# EasyEDA Pro project ProDoc_小板子变色龙0603_2025-04-27.epro

# Board 小板子变色龙0603
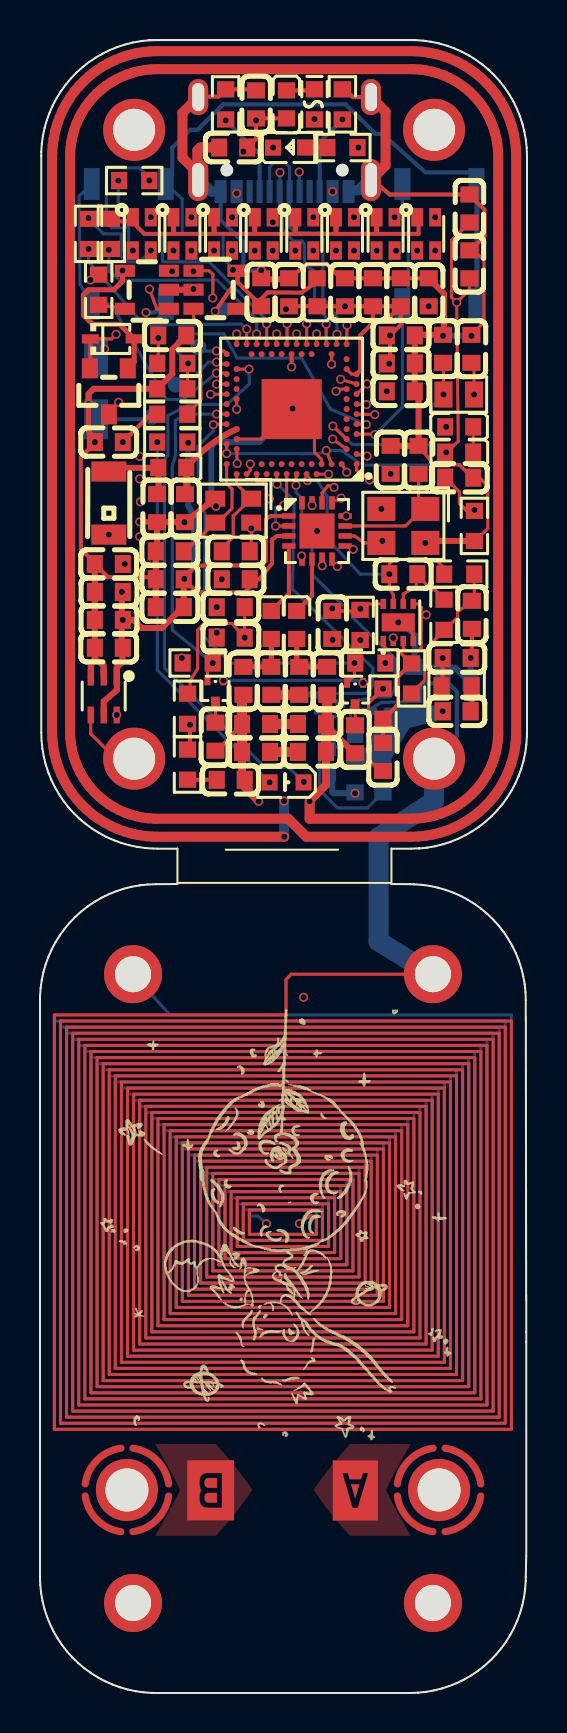
[diagram p0: board, top side]
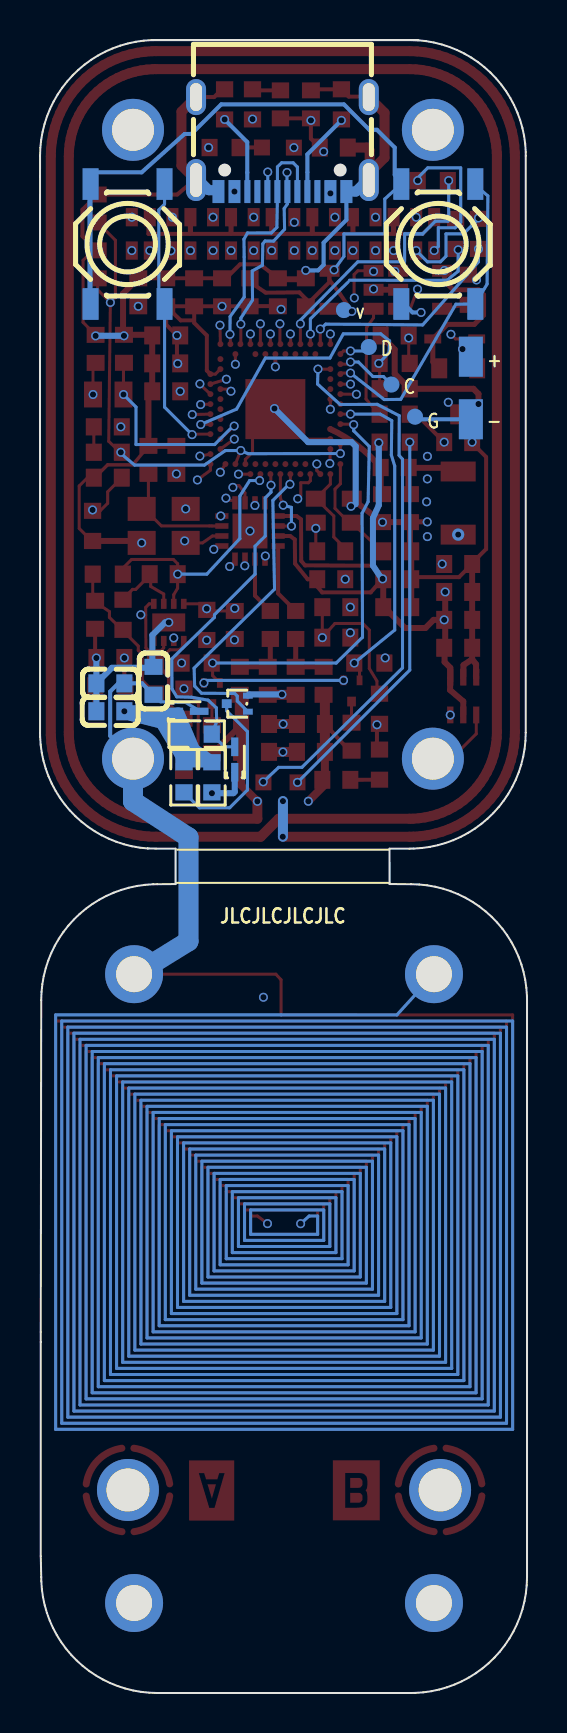
[diagram p1: board, bottom side, seen from below]

Outline 24.36 x 82.67 mm; copper layers: Top Layer, 内层1, Inner2, Bottom Layer. Coordinates in mm from the lower left corner of the outline.
Outline path: 5.46,82.67 18.77,82.67 ; 24.32,17.57 24.32,6.85 24.3,5.8 24.3,5.6 24.27,5.19 24.21,4.79 24.13,4.4 24.02,4.01 23.88,3.63 23.71,3.26 23.52,2.9 23.31,2.56 23.07,2.23 22.81,1.92 22.53,1.63 22.23,1.36 21.91,1.11 21.57,0.88 21.22,0.68 20.86,0.5 20.48,0.35 20.1,0.23 19.71,0.13 19.31,0.06 18.9,0.02 18.5,0 15.01,0 9.39,0 5.8,0 5.6,0 5.19,0.03 4.79,0.09 4.4,0.17 4.01,0.28 3.63,0.42 3.26,0.59 2.9,0.78 2.56,0.99 2.23,1.23 1.92,1.49 1.63,1.77 1.36,2.07 1.11,2.39 0.88,2.73 0.68,3.08 0.5,3.44 0.35,3.82 0.22,4.2 0.13,4.59 0.06,4.99 0.01,5.4 0,5.8 0,34.65 0,34.85 0.03,35.26 0.09,35.66 0.17,36.05 0.28,36.44 0.42,36.82 0.59,37.19 0.78,37.55 0.99,37.89 1.23,38.22 1.49,38.53 1.77,38.82 2.07,39.09 2.39,39.34 2.73,39.57 3.08,39.77 3.44,39.95 3.82,40.1 4.2,40.23 4.59,40.32 4.99,40.39 5.4,40.44 5.8,40.45 6.87,40.46 6.88,42.23 5.86,42.23 5.66,42.23 5.26,42.26 4.86,42.32 4.46,42.4 4.07,42.51 3.69,42.65 3.32,42.82 2.96,43.01 2.62,43.22 2.29,43.46 1.98,43.72 1.69,44 1.42,44.3 1.17,44.62 0.95,44.96 0.74,45.31 0.57,45.67 0.41,46.05 0.29,46.43 0.19,46.82 0.12,47.22 0.08,47.63 0.06,48.03 0.06,76.88 0.06,77.08 0.09,77.48 0.15,77.88 0.23,78.28 0.34,78.67 0.48,79.05 0.65,79.42 0.84,79.77 1.05,80.12 1.29,80.44 1.55,80.75 1.83,81.05 2.13,81.32 2.45,81.57 2.79,81.79 3.14,81.99 3.5,82.17 3.88,82.32 4.26,82.45 4.65,82.55 5.05,82.62 5.46,82.66 5.86,82.67 18.56,82.67 18.76,82.67 19.17,82.64 19.57,82.58 19.96,82.5 20.35,82.39 20.73,82.25 21.1,82.09 21.46,81.9 21.8,81.68 22.13,81.44 22.44,81.18 22.73,80.9 23,80.6 23.25,80.28 23.48,79.95 23.68,79.6 23.86,79.23 24.01,78.86 24.13,78.47 24.23,78.08 24.3,77.68 24.35,77.28 24.36,76.87 24.36,75.84 24.36,65.14 24.36,48.02 24.36,47.82 24.33,47.42 24.27,47.02 24.19,46.62 24.08,46.23 23.94,45.85 23.77,45.48 23.58,45.12 23.37,44.78 23.13,44.45 22.87,44.14 22.59,43.85 22.29,43.58 21.97,43.33 21.63,43.1 21.28,42.9 20.92,42.72 20.54,42.57 20.16,42.45 19.77,42.35 19.37,42.28 18.96,42.24 18.97,42.24 18.56,42.23 17.58,42.23 17.58,40.46 18.5,40.45 18.7,40.45 19.11,40.42 19.51,40.36 19.9,40.28 20.29,40.17 20.67,40.03 21.04,39.86 21.4,39.67 21.74,39.46 22.07,39.22 22.38,38.96 22.67,38.68 22.94,38.38 23.19,38.06 23.42,37.72 23.62,37.37 23.8,37.01 23.95,36.63 24.08,36.25 24.17,35.86 24.24,35.46 24.29,35.06 24.3,34.65 24.32,18.06 24.32,17.54
Stack: Top Layer 0.035mm / Dielectric1 1.51mm FR4 er 4.5 / 内层1 0.035mm / Dielectric2 0.48mm PP er 4.5 / Inner2 0.035mm / Dielectric3 0.48mm PP er 4.5 / Bottom Layer 0.035mm

## Design rules (mm)
template: 自定义配置
spacing copperThickness1oz (default): track to track 0.102, other pairs 0 to 0.3
spacing copperThickness2oz: track to track 0.203, other pairs 0.152 to 0.3
track width copperThickness1oz (default): min 0.127, default 0.254, max 2.54
track width copperThickness2oz: min 0.203, default 0.254, max 2.54
differential pair differentialPair (default): width min 0.127, default 0.254, max 2.54; gap min 0.152, default 0.152
via viaSize (default): diameter min 0.4, default 0.61, max 10; hole min 0.3, default 0.305, max 6.3

## Placement (name value [footprint] x y rotation side)
C1  12pF  [C0603]  18.94 61.67 90 top
C2  12pF  [C0603]  17.54 61.67 90 top
C3  100nF  [C0603]  6.49 54.31 180 top
C4  100nF  [C0603]  9.79 55.7 180 top
C5  100nF  [C0603]  6.49 55.7 180 top
C6  100nF  [C0603]  3.44 55.07 180 top
C7  4.7uF  [C0603]  3.44 53.67 180 top
C8  1uF  [C0603]  9.54 54.31 180 top
C9  100nF  [C0603]  9.54 52.78 180 top
C10  1nF/NP0  [C0603]  8.78 47.83 90 top
C11  1nF/NP0  [C0603]  15.76 47.7 90 top
C12  47pF/NP0  [C0603]  10.17 50.62 90.2 top
C13  47pF/NP0  [C0603]  14.37 50.62 270.1 top
C14  47pF/NP0  [C0603]  11.57 50.62 270 top
C15  47pF/NP0  [C0603]  12.97 50.62 270 top
C16  8pF  [C0603]  13.6 48.46 180 top
C17  8pF  [C0603]  10.81 48.46 0 top
C18  150pF/NP0  [C0603]  10.81 47.07 0 top
C19  150pF/NP0  [C0603]  13.6 47.07 180 top
C20  100nF  [C0603]  9.54 45.67 0 top
C21  4.7uF  [C0603]  3.44 52.27 0 top
C22  -  [C0603]  20.84 50.5 0 bottom
C23  2.2nF/C0G  [C0603]  18.68 50.62 90 bottom
C25  100nF  [C0603]  14.62 53.42 270 top
C26  100nF  [C0603]  21.6 53.93 270 top
C27  10nF  [C0603]  18.18 55.96 0 top
C28  100nF  [C0603]  20.97 60.78 180 top
C29  27nF  [C0603]  20.84 49.1 180 bottom
C30  10nF  [C0603]  20.84 49.1 180 top
C31  33nF  [C0603]  20.84 51.77 180 top
C32  4.7uF  [C0603]  9.67 77.29 180 top
C33  100nF  [C0603]  15.25 70.05 90 top
C34  4.7uF  [C0603]  19.45 70.05 90 top
C35  4.7uF  [C0603]  16.65 70.05 90 top
C36  12pF  [C0603]  21.58 67.23 270 top
C37  12pF  [C0603]  20.16 67.23 270 top
C38  100nF  [C0603]  18.05 65.1 180 top
C39  4.7uF  [C0603]  18.05 67.9 180 top
C40  12pF  [C0603]  6.49 57.1 180 top
C41  12pF  [C0603]  9.79 57.1 0 top
C42  100nF  [C0603]  18.05 70.05 90 top
C43  100nF  [C0603]  18.05 66.5 180 top
C44  1uF  [C0603]  21.48 71.45 270 top
C45  47nF  [C0603]  21.48 74.25 270 top
C46  100nF  [C0603]  12.46 70.05 90 top
C47  1nF  [C0603]  17.16 46.81 90 top
D1  1N4148WT  [SOD-523_L1.2-W0.8-LS1.6-RD]  17.03 49.1 180 bottom
D2  1N4148WT  [SOD-523_L1.2-W0.8-LS1.6-RD]  14.62 46.69 90 bottom
F1  F0603E1R25FSTR  [F0603]  13.73 79.45 270 top
L1  680nH  [L0603]  11.57 53.42 90 top
L2  680nH  [L0603]  12.84 53.42 90 top
L3  4.7nH  [L0603]  6.62 61.29 180 top
L4  10uH  [L0603]  20.97 63.32 0 top
L5  15nH  [L0603]  20.97 62.05 180 top
LED1  RSGHBHW1  [LED-ARRAY-SMD_4P-L1.6-W1.6-TR_EVERLIGHT_RSGHBHW1-S03]  19.32 72.98 90 top
LED2  RSGHBHW1  [LED-ARRAY-SMD_4P-L1.6-W1.6-TR_EVERLIGHT_RSGHBHW1-S03]  17.29 72.98 90 top
LED3  RSGHBHW1  [LED-ARRAY-SMD_4P-L1.6-W1.6-TR_EVERLIGHT_RSGHBHW1-S03]  15.25 72.98 90 top
LED4  RSGHBHW1  [LED-ARRAY-SMD_4P-L1.6-W1.6-TR_EVERLIGHT_RSGHBHW1-S03]  9.16 72.98 90 top
LED5  RSGHBHW1  [LED-ARRAY-SMD_4P-L1.6-W1.6-TR_EVERLIGHT_RSGHBHW1-S03]  11.19 72.98 90 top
LED6  RSGHBHW1  [LED-ARRAY-SMD_4P-L1.6-W1.6-TR_EVERLIGHT_RSGHBHW1-S03]  13.22 72.98 90 top
LED8  RSGHBHW1  [LED-ARRAY-SMD_4P-L1.6-W1.6-TR_EVERLIGHT_RSGHBHW1-S03]  5.09 72.98 90 top
LED9  RSGHBHW1  [LED-ARRAY-SMD_4P-L1.6-W1.6-TR_EVERLIGHT_RSGHBHW1-S03]  7.13 72.98 90 top
NOREF  -  [Pad_e1377]  9.16 69.17 270 top
NOREF#2  -  [Pad_e1375]  6.78 65.44 270 top
NOREF#3  -  [Pad_e1382]  19.66 35.95 180 top
NOREF#4  -  [Pad_ie1378]  2.81 66.83 0 top
NOREF#5  -  [Pad_ie1373]  2.81 63.7 0 top
NOREF#6  -  [Pad_e1376]  7.91 67.32 270 top
NOREF#7  -  [Pad_e1384]  19.96 10.16 180 top
NOREF#8  -  [Pad_e1381]  4.66 4.5 270 top
NOREF#9  -  [Pad_e1380]  4.66 35.95 180 top
NOREF#10  -  [Pad_e1379]  4.35 10.16 180 top
NOREF#11  -  [Pad_e1383]  19.66 4.5 270 top
NOREF#12  -  [Pad_e1374]  5.6 63.83 270 top
P1  -  [M1.6贴片螺母]  4.71 78.18 0 top
P2  -  [M1.6贴片螺母]  19.71 78.18 0 top
P3  -  [M1.6贴片螺母]  4.71 46.73 0 top
P4  -  [M1.6贴片螺母]  19.71 46.73 0 top
PIC1  -  [小王子图_23_22]  12.16 23.17 180 top
Q1  WNM3013-3/TR  [SOT-723_L1.2-W0.8-P0.40-LS1.2-BR]  15.76 49.99 90 top
Q2  WNM3013-3/TR  [SOT-723_L1.2-W0.8-P0.40-LS1.2-BR]  8.78 50.12 90 top
Q3  WNM3013-3/TR  [SOT-723_L1.2-W0.8-P0.40-LS1.2-BR]  14.49 49.48 180 bottom
Q4  AO3401A  [SOT-23_L2.9-W1.3-P1.90-LS2.4-BR]  3.44 65.1 90 top
R1  5.1K  [R0603]  9.29 79.45 90 top
R2  5.1K  [R0603]  15.13 79.45 90 top
R3  1K  [R0603]  3.57 72.98 90 top
R4  2K  [R0603]  4.71 75.64 0 top
R5  1K  [R0603]  2.43 72.98 90 top
R6  2K  [R0603]  6.62 62.56 180 top
R7  100K  [R0603]  7.89 51.51 0 top
R8  100K  [R0603]  16.52 51.51 0 top
R9  5.1K  [R0603]  7.38 46.43 270 top
R10  100K  [R0603]  6.62 63.96 0 top
R11  1M  [R0603]  6.62 66.5 0 top
R12  820R  [R0603]  7.38 49.23 270 top
R13  4.7K  [R0603]  2.94 70.18 90 top
R14  1M  [R0603]  6.62 65.23 180 top
R15  220R  [R0603]  17.16 45.8 270 bottom
R16  1K  [R0603]  15.13 77.29 180 top
R17  470K  [R0603]  16.52 47.96 180 bottom
R18  82R  [R0603]  18.59 50.74 270 top
R19  75R  [R0603]  20.21 53.93 90 top
R20  3K  [R0603]  20.97 55.96 0 top
R21  3K  [R0603]  21.73 58.37 90 top
R22  4.7K  [R0603]  16.02 53.42 90 top
R23  470K  [R0603]  15.76 45.8 90 bottom
R24  82R  [R0603]  20.84 50.37 180 top
R25  4.7K  [R0603]  17.16 49.48 270 top
SW1  -  [SW-SMD_4P-L5.2-W5.2-P3.70-LS6.4-BL]  19.98 72.47 270 bottom
SW2  -  [SW-SMD_4P-L5.2-W5.2-P3.70-LS6.4-BL]  4.44 72.47 270 bottom
U1  CHARGE  [LED0603-RD]  12.46 77.29 0 top
U2  LED0603  [LED0603-R-RD]  12.33 45.54 180 top
U3  -  [AQFN-73_L7.0-W7.0-P0.50-BL-EP4.8]  12.59 64.21 90 top
U4  13.56MHz  [QFN-16_L3.0-W3.0-P0.50-BL-EP1.7]  13.86 58.12 270 top
U5  10uF  [C0603]  6.62 67.9 180 top
U6  1uF  [C0603]  10.81 79.45 270 top
U7  RS2257XC6  [SC-70-6_L2.2-W1.3-P0.65-LS2.2-BR]  3.19 49.86 90 top
U8  1uF  [C0603]  11.06 70.05 270 top
U9  GS358-FR  [DFN-8_L2.0-W2.0-P0.50-BL-EP]  17.92 53.54 0 top
U10  100MHz/0R  [L0603]  13.86 70.05 90 top
U11  0.5pF  [C0603]  7.25 59.26 270 top
U12  0.8pF  [C0603]  5.86 59.26 270 top
U13  ANT3216LL00R2400A  [ANT-SMD_L3.2-W1.6]  3.44 59.51 90 top
U14  1uF  [C0603]  3.44 62.56 0 top
U15  RT9013-33GB  [SOT-23-5_L2.9-W1.6-P0.95-LS2.8-BR]  8.78 70.18 180 top
U16  100nF  [C0603]  3.44 56.47 0 top
U19  100MHz/600R  [L0603]  12.33 79.45 90 top
U31  LTH7R/4054  [SOT-23-5_L2.9-W1.6-P0.95-LS2.8-BR]  5.35 70.18 0 top
U32  SS14  [SOD-323_L1.7-W1.3-LS2.7-FD]  3.62 67.72 180 top
USB1  TYPE-C16PIN  [USB-C-SMD_TYPE-C16PIN]  12.24 77.46 0 bottom
X1  27.12MHz  [CRYSTAL-SMD_4P-L3.2-W2.5-BL]  18.18 58.37 180 top
X2  32MHz  [OSC-SMD_4P-L2.0-W1.6-BL]  9.67 59.13 180 top
X3  32.768kHz  [CRYSTAL-SMD_L2.0-W1.2]  20.95 64.94 0 top

## Footprints (pads in the part's own frame, mm; a bottom-side part is the same pattern mirrored in y, then rotated)
ANT-SMD_L3.2-W1.6
  rect 1x1.75 smd: 1(-1.578,0) 2(1.578,0)
AQFN-73_L7.0-W7.0-P0.50-BL-EP4.8
  rect 3x3 smd: 0(0,0)
  round 0.3 smd: A8(-3.25,-1.25) A10(-3.25,-0.75) A12(-3.25,-0.25) A14(-3.25,0.25) A16(-3.25,0.75) A18(-3.25,1.25) A20(-3.25,1.75) A22(-3.25,2.25) A23(-3.25,2.75) AA24(2.25,3.25) AB2(2.5,-2.75) AC5(2.75,-2) AC9(2.75,-1) AC11(2.75,-0.5) AC13(2.75,0) AC15(2.75,0.5) AC17(2.75,1) AC19(2.75,1.5) AC21(2.75,2) AC24(2.75,3.25) AD2(3.25,-2.75) AD4(3.25,-2.25) AD6(3.25,-1.75) AD8(3.25,-1.25) AD10(3.25,-0.75) AD12(3.25,-0.25) AD14(3.25,0.25) AD16(3.25,0.75) AD18(3.25,1.25) AD20(3.25,1.75) AD22(3.25,2.25) AD23(3.25,2.75) B1(-2.75,-3.25) B3(-2.75,-2.499) B5(-2.75,-2) B7(-2.75,-1.5) B9(-2.75,-1) B11(-2.75,-0.5) B13(-2.75,0) B15(-2.75,0.5) B17(-2.75,1) B19(-2.75,1.5) B24(-2.75,3.25) C1(-2.25,-3.25) D2(-2,-2.75) D23(-2,2.75) E24(-1.75,3.25) F2(-1.5,-2.75) F23(-1.5,2.75) G1(-1.25,-3.25) H2(-1,-2.75) H23(-1,2.75) J1(-0.75,-3.25) J24(-0.75,3.25) K2(-0.5,-2.75) L1(-0.25,-3.25) L24(-0.25,3.25) M2(0,-2.75) N1(0.25,-3.25) N24(0.25,3.25) P2(0.5,-2.75) P23(0.5,2.75) R1(0.75,-3.25) R24(0.75,3.25) T2(1,-2.75) T23(1,2.75) U1(1.25,-3.25) U24(1.25,3.25) V23(1.5,2.75) W1(1.75,-3.25) W24(1.75,3.25) Y2(2,-2.75) Y23(2,2.75)
C0603
  rect 0.8x0.9 smd: 1(-0.7,0) 2(0.7,0)
CRYSTAL-SMD_4P-L3.2-W2.5-BL
  rect 1.4x1.2 smd: 1(-1.1,-0.85) 2(1.1,-0.85) 3(1.1,0.85) 4(-1.1,0.85)
CRYSTAL-SMD_L2.0-W1.2
  rect 0.9x1.3 smd: 1(-0.762,0) 2(0.762,0)
DFN-8_L2.0-W2.0-P0.50-BL-EP
  rect 0.28x0.505 smd: 1(-0.75,-0.927) 2(-0.25,-0.927) 3(0.25,-0.927) 4(0.75,-0.927) 5(0.75,0.927) 6(0.25,0.927) 7(-0.25,0.927) 8(-0.75,0.927)
  rect 1.65x0.9 smd: 9(0,0)
F0603
  rect 0.806x0.864 smd: 1(-0.753,0) 2(0.753,0)
L0603
  rect 0.8x0.864 smd: 1(-0.7,0) 2(0.7,0)
LED0603-R-RD
  rect 0.8x0.8 smd: 1(0.851,0) 2(-0.851,0)
LED0603-RD
  rect 0.8x0.8 smd: 1(-0.799,-0.004) 2(0.799,0.004)
LED-ARRAY-SMD_4P-L1.6-W1.6-TR_EVERLIGHT_RSGHBHW1-S03
  rect 0.917x0.6 smd: 1(0.834,0.45) 2(-0.834,0.45) 3(-0.834,-0.45) 4(0.834,-0.45)
M1.6贴片螺母
  round 3.1 hole 2.1: 1(0,0)
OSC-SMD_4P-L2.0-W1.6-BL
  rect 1x0.8 smd: 1(-0.9,-0.6) 2(0.9,-0.6) 3(0.9,0.6) 4(-0.9,0.6)
Pad_e1374
  round 0.8 smd far side: 1(0,0)
Pad_e1375
  round 0.8 smd far side: 1(0,0)
Pad_e1376
  round 0.8 smd far side: 1(0,0)
Pad_e1377
  round 0.8 smd far side: 1(0,0)
Pad_e1379
  round 3.099 hole 2.15: 2(0,0)
Pad_e1380
  round 2.9 hole 1.8: 1(0,0)
Pad_e1381
  round 2.9 hole 1.8: 1(0,0)
Pad_e1382
  round 2.9 hole 1.8: 1(0,0)
Pad_e1383
  round 2.9 hole 1.8: 1(0,0)
Pad_e1384
  round 3.099 hole 2.15: 2(0,0)
Pad_ie1373
  rect 1.2x2 smd far side: 1(0,0)
Pad_ie1378
  rect 1.2x2 smd far side: 1(0,0)
QFN-16_L3.0-W3.0-P0.50-BL-EP1.7
  rect 0.28x0.665 smd: 1(-0.75,-1.407) 2(-0.25,-1.407) 3(0.25,-1.407) 4(0.75,-1.407) 9(0.75,1.407) 10(0.25,1.407) 11(-0.25,1.407) 12(-0.75,1.407)
  rect 0.665x0.28 smd: 5(1.407,-0.75) 6(1.407,-0.25) 7(1.407,0.25) 8(1.407,0.75) 13(-1.407,0.75) 14(-1.407,0.25) 15(-1.407,-0.25) 16(-1.407,-0.75)
  rect 1.75x1.75 smd: 17(0,0)
R0603
  rect 0.806x0.864 smd: 1(-0.753,0) 2(0.753,0)
SC-70-6_L2.2-W1.3-P0.65-LS2.2-BR
  rect 0.841x0.315 smd: 1(0.946,-0.65) 2(0.946,0) 3(0.946,0.65) 4(-0.946,0.65) 5(-0.946,0) 6(-0.946,-0.65)
SOD-323_L1.7-W1.3-LS2.7-FD
  rect 0.845x0.455 smd: 1(-1.097,0) 2(1.097,0)
SOD-523_L1.2-W0.8-LS1.6-RD
  rect 0.93x0.36 smd: 1(-0.635,0) 2(0.635,0)
SOT-23-5_L2.9-W1.6-P0.95-LS2.8-BR
  rect 1x0.6 smd: 1(1.1,-0.95) 2(1.1,0) 3(1.1,0.95) 4(-1.1,0.95) 5(-1.1,-0.95)
SOT-23_L2.9-W1.3-P1.90-LS2.4-BR
  rect 1x0.8 smd: 1(1.15,-0.95) 2(1.15,0.95) 3(-1.15,0)
SOT-723_L1.2-W0.8-P0.40-LS1.2-BR
  rect 0.489x0.294 smd: 1(0.529,-0.4) 2(0.529,0.4)
  rect 0.489x0.434 smd: 3(-0.529,0)
SW-SMD_4P-L5.2-W5.2-P3.70-LS6.4-BL
  rect 1.58x0.8 smd: 1(-3,-1.85) 2(3,-1.85) 3(-3,1.85) 4(3,1.85)
USB-C-SMD_TYPE-C16PIN
  oval 1x2.1 hole 0.6x1.7: 1(-4.32,1.788) 2(4.32,1.788)
  oval 1x1.8 hole 0.6x1.4: 3(-4.32,-2.362) 4(4.32,-2.362)
  rect 0.6x1.15 smd: A1B12(-3.2,2.362) A4B9(-2.4,2.362) B1A12(3.2,2.362) B4A9(2.4,2.362)
  rect 0.3x1.15 smd: A5(-1.25,2.362) A6(-0.25,2.362) A7(0.25,2.362) A8(-1.75,2.362) B5(1.75,2.362) B6(0.75,2.362) B7(-0.75,2.362) B8(1.25,2.362)

## Nets
3V3: C3.1 C4.1 C5.1 C6.1 C7.1 C21.2 NOREF.1 R6.1 SW1.1 SW1.2 SW2.1 SW2.2 U4.1 U4.3 U4.5 U4.7 U7.1 U7.5 U8.2 U10.2 U15.5
5V: C32.1 Q4.1 R16.1 U3.AD2 U6.2 U19.1 U31.4 U32.1
GND: C1.2 C2.2 C3.2 C4.2 C5.2 C6.2 C7.2 C8.2 C9.2 C10.1 C11.1 C12.1 C13.2 C14.2 C15.2 C16.1 C16.2 C17.1 C17.2 C18.1 C18.2 C19.1 C19.2 C20.2 C21.1 C22.2 C23.2 C25.2 C26.2 C28.1 C29.1 C31.1 C32.2 C33.2 C34.2 C35.2 C36.1 C37.1 C38.1 C39.1 C40.2 C41.2 C42.2 C43.1 C44.1 C45.1 C46.2 D2.1 NOREF#5.1 NOREF#12.1 Q3.2 R1.2 R2.2 R7.1 R8.2 R13.2 R14.2 R21.1 R23.1 U3.0 U3.B7 U3.F23 U4.17 U5.1 U6.1 U7.2 U7.3 U8.1 U9.4 U9.9 U11.2 U12.2 U14.1 U15.2 U16.1 U31.2 USB1.1 USB1.2 USB1.3 USB1.4 USB1.A1B12 USB1.B1A12 X1.2 X1.4 X2.2 X2.4
VBAT_SENSE: R11.2 R14.1 U3.J1
VBUS: F1.1 U19.2
VCCNRF: C33.1 C35.1 C39.2 C42.1 C43.2 C46.1 U3.A22 U3.AD14 U3.AD23 U3.B1 U3.W1 U3.Y2 U10.1
VIN: Q4.2 R10.1 U14.2 U15.1 U32.2
BAT: NOREF#4.1 Q4.3 R11.1 U5.2 U31.3
C13_1: C13.1 C15.1 L2.1
C20_1: C20.1 R9.2
C30_1: C30.1 R24.1
J2_A5: R1.1 USB1.A5
J2_B5: R2.1 USB1.B5
KEY_A: SW1.3 SW1.4 U3.G1
KEY_B: SW2.3 SW2.4 U3.W24
L1_1: C12.2 C14.1 L1.1
L3_2: L3.2 U12.1 U13.2
L4_2: L4.2 L5.1
LED1: LED1.4 U3.L1
LED1_1: LED1.1 LED2.1 LED3.1 LED4.1 LED5.1 LED6.1 LED8.1 LED9.1 R3.2
LED1_2: LED1.2 LED2.2 LED3.2 LED4.2 LED5.2 LED6.2 LED8.2 LED9.2 R4.2
LED1_3: LED1.3 LED2.3 LED3.3 LED4.3 LED5.3 LED6.3 LED8.3 LED9.3 R5.2
LED2: LED2.4 U3.N1
LED3: LED3.4 U3.R1
LED4: LED6.4 U3.U1
LED5: LED5.4 U3.AD8
LED6: LED4.4 U3.AD10
LED7: LED9.4 U3.AD12
LED8: LED8.4 U3.AD16
LED_B_H: R5.1 U3.AD22
LED_G_H: R4.1 U3.AD18
LED_R_H: R3.1 U3.AD20
LEDFILELD: U2.2 U3.Y23
LF_AMP_PWR: C25.1 R22.2 U3.A14 U4.2 U9.8
LF_ANT_DRV: U3.A8 U7.6
LF_ENV_DETE: C31.2 C47.1 R24.2 R25.1 U9.2
LF_MOD: Q3.1 U3.A16
LF_OA: C29.2 C30.2 D1.1 R15.1 R17.1 R23.2
LF_OA1: C47.2 R18.1 R25.2 U9.1
LF_OA_OUT: C27.1 R20.1 U3.A10 U9.7
LF_RSSI: D2.2 R17.2 U3.A12
LF_VBIAS: C28.2 R21.2 R22.1 U9.3 U9.5
MISO: U3.T2 U4.12
MOSI: U3.P23 U4.13
NFC_ANT_SEL: Q1.1 Q2.1 U3.A20
NFC_NRF_A: Q1.2 R8.1 U3.J24
NFC_NRF_B: Q2.2 R7.2 U3.L24
NSS: U3.R24 U4.15
OSC27IN: C1.1 U4.11 X1.1
OSC27OUT: C2.1 U4.10 X1.3
P_LF_ANT_DRV: P3.1 U7.4
P_LF_ANT_RAW: C22.1 C23.1 D1.2 NOREF#3.1 NOREF#9.1 P4.1
Q1_3: C11.2 Q1.3
Q2_3: C10.2 Q2.3
Q3_3: Q3.3 R15.2
R6_2: R6.2 U2.1
R10_2: R10.2 U15.3
R13_1: R13.1 U31.5
R18_2: C26.1 R18.2 R19.1 R20.2
RESET: U3.AC13
RX: R9.1 R12.2 U4.9
SCK: U3.U24 U4.14
SWCLK: NOREF#2.1 U3.AA24
SWDIO: NOREF#6.1 U3.AC24
TX1: L1.2 U4.4
TX2: L2.2 U4.6
U1_2: R16.2 U1.2
U3_A23: C41.1 U3.A23 X2.1
U3_AC5: C34.1 U3.AC5
U3_B3: L4.1 U3.B3
U3_B24: C40.1 U3.B24 X2.3
U3_C1: C38.2 U3.C1
U3_D2: C36.2 U3.D2 X3.2
U3_D23: U3.D23 U16.2
U3_E24: C44.2 C45.2 L5.2 U3.B5 U3.E24
U3_F2: C37.2 U3.F2 X3.1
U3_H23: L3.1 U3.H23 U11.1
U9_6: C27.2 R19.2 U9.6
U31_1: U1.1 U31.1
USB+: U3.AD6 USB1.A6 USB1.B6
USB-: U3.AD4 USB1.A7 USB1.B7
VMID: C8.1 C9.1 R12.1 U4.8
VUSB: F1.2 USB1.A4B9 USB1.B4A9

Pads without a net: NOREF#7 2; NOREF#8 1; NOREF#10 2; NOREF#11 1; P1 1; P2 1; U3 A18 AB2 AC9 AC11 AC15 AC17 AC19 AC21 B9 B11 B13 B15 B17 B19 H2 K2 M2 N24 P2 T23 V23; U4 16; U13 1; U15 4; USB1 A8 B8

## Via types
v1: diameter 0.61, hole 0.305, Top Layer to Bottom Layer, 1 via
v2: diameter 0.45, hole 0.31, Top Layer to Bottom Layer, 184 vias

## Routing (per net, layer and track width the routed paths; a pad name or vN(x,y) marks a point on that pad's centre or on a via; arc(x,y) is an arc through that point)
3V3: length 109
  Top Layer w0.2: 7.19,55.77 7.82,55.04 10.24,55.04 10.49,55.34 C4.1 10.97,55.7 11.6,56.48 11.62,57.69 11.85,57.87 12.45,57.87 ; C5.1 7.76,56.38 11.1,56.4 11.3,56.62 11.3,58.7 11.53,58.87 12.45,58.87 ; v2(8.76,69.1) 9.35,69.96 9.89,70.68 9.89,71.12 ; U15.5 9.89,71.12 ; 9.89,71.12 9.89,70.56 11.06,69.38 11.06,69.72 11.38,70.05 13.07,70.04 13.86,70.57 U10.2
  Top Layer w0.3: U7.5 3.19,49.6 3.85,50.16 3.84,50.73 ; 3.84,50.81 3.84,51.28 4.12,51.56 4.12,52.25 C21.2 ; v2(4.09,55.07) 4.09,53.72 v2(4.14,53.67) ; v2(4.14,53.67) 4.09,53.62 4.09,52.27 ; v2(4.14,53.67) 4.68,53.67 5.08,53.27 6.1,53.27 7.14,54.31 ; C3.1 C5.1
  内层1 w0.2: v2(5.3,69.05) 6.24,69.03 6.57,69.68 7.97,69.68 8.39,70.28 9.08,70.19 9.18,69.64 8.76,69.12 v2(8.76,69.1)
  内层1 w0.3: C6.1 4.43,55.23 11.24,55.21 v2(13.09,56.86) ; v2(4.14,53.67) 11.41,53.67 v2(14.12,56.38)
  Inner2 w0.3: v2(7.41,62.53) 7.41,65.39 8,65.84 8.02,68.29 v2(8.76,69.1)
  Bottom Layer w0.152: SW2.1 7.12,74.72 7.12,72.98 9.16,72.98 9.16,71.85 v2(9.65,71.18)
  Bottom Layer w0.2: v2(5.3,69.05) 5.73,69.05 6.15,69.47 SW2.2 ; 6.33,75.64 6.62,75.93 6.62,77.29 7.51,78.18 7.89,78.18 9.16,79.45 15.3,79.45 16.78,77.97 17.13,77.97 19.28,76.06 21.83,76.06
  Bottom Layer w0.254: 21.86,69.64 21.86,75.44 SW1.1
  Bottom Layer w0.3: v2(7.41,62.53) 7.41,59.41 7.71,58.76 7.71,56.39 7.25,55.7
  vias: v2(7.22,55.72)
5V: length 55.3
  Top Layer w0.152: U3.AD2 v2(15.36,68.41)
  Top Layer w0.2: C32.1 10.81,77.74 v2(10.81,78.65) 10.91,78.75 12.33,78.75
  Top Layer w0.25: v2(4.13,71.15) 4.13,70.62 3.69,70.18 2.43,70.18 2.17,69.93 2.17,68.91 2.64,68.45 3.99,68.45 U32.1 4.71,66.57 Q4.1
  内层1 w0.2: 10.23,77.14 10.65,77.14 11.17,76.63 13.84,76.63 15.19,77.97 17.13,77.97 19.62,75.73 20.29,75.15 20.32,71.59 19.92,71.22 16.32,71.2 15.95,70.75 15.95,68.83 15.42,68.46
  Inner2 w0.203: U31.4 4.31,71.2 5.72,71.2 6.12,71.6 6.12,72.98 6.62,73.47 6.62,77.29 7,77.67 9.59,77.67 ; 9.54,77.67 9.83,77.67 v2(10.81,78.65)
  Inner2 w0.3: v2(10.81,78.65) 11.6,79.45 15.46,79.45 15.93,78.67 v2(15.93,77.29)
  vias: v2(10.17,77.09)
GND: length 18.8
  Top Layer w0.2: 7.92,79.84 8.92,79.84 R1.2 10.81,80.21 U6.1 ; USB1.4 15.65,79.82 15.26,80.21 R2.2
  Top Layer w0.5: USB1.2 17.29,76.4 17.29,79.09 USB1.4 ; USB1.3 7.13,79.03 7.13,76.79 7.87,76.04 7.87,77.15 8.02,77.29 C32.2
  Bottom Layer w0.5: USB1.A1B12 8.57,75.09 7.99,75.67 USB1.1 ; 15.44,75.16 15.92,75.16 16.37,75.61 16.56,75.61
  vias: v2(2.43,64.47) v2(2.53,70.67) v2(2.75,62.56) v2(4.98,61.85) v2(4.99,60.72) v2(4.99,57.83) v2(5.02,59.58) v2(4.99,58.57) v2(7.09,51.77) v2(7.23,58.56) v2(7.68,70.22) v2(8.8,59.35) v2(8.84,54.31) v2(8.84,53.03) v2(9.09,55.7) v2(10.57,58.25) v2(10.94,44.6) v2(11.07,71.15) v2(12.26,49.94) v2(12.2,48.46) v2(12.21,47.06) v2(12.21,44.61) v2(12.22,42.82) v2(12.63,64.24) v2(13.49,44.6) v2(13.86,58.12) v2(14.64,52.67) v2(15.76,45) v2(17.08,59.22) v2(17.28,51.51) v2(17.92,53.54) v2(19.28,57.52) v2(20.16,67.88) v2(21.58,67.88) v2(21.54,51.77)
VBAT_SENSE: length 15
  Top Layer w0.152: 7.37,65.23 7.37,66.46 v2(7.41,66.5) ; U3.J1 16.33,63.44
  Bottom Layer w0.152: v2(7.41,66.5) 6.9,67.04 6.87,67.62 7.32,67.98 9.19,67.98 9.86,66.77 13.09,66.77 14.53,64.21 16.33,63.44
  vias: v2(16.32,63.44)
VBUS: length 1.4
  Top Layer w0.2: U19.2 13.68,80.15 F1.1
VCCNRF: length 44.1
  Top Layer w0.152: U3.AD23 v2(9.84,67.97) ; U3.A22 10.52,61.14 v2(10.52,61.47) ; v2(12.36,68.48) 12.36,67.48 U3.AD14 ; U3.Y2 15.59,65.96 U3.W1 ; U3.B1 15.84,61.15 v2(16.49,60.67)
  Top Layer w0.2: C46.1 12.47,69.36 13.86,69.36 ; 13.86,69.35 17.98,69.35 18.05,69.42 ; U3.W1 16.02,66.14 16.02,67.9 16.65,68.53 16.65,69.4 ; 16.65,68.65 17.32,68.65 18.05,69.35 ; v2(17.47,66.49) 17.51,66.52 v2(17.51,67.9) 18.05,68.44 18.05,69.39
  内层1 w0.152: v2(12.36,68.48) 12.5,68.48 13.38,69.35 v2(15.25,69.35) ; v2(16.49,60.67) 18.06,62.41 18.06,67.21 v2(17.51,67.9)
  内层1 w0.2: v2(10.52,61.47) 10.52,65.47 10.75,65.74 14.43,65.74 15.27,66.49 v2(17.47,66.49)
  Inner2 w0.2: v2(9.84,67.97) 9.84,68.66 10.22,69.04 12.14,69.04 v2(12.3,69.2)
VIN: length 23.2
  Top Layer w0.152: U32.2 3.58,67.72 v2(3.81,67.95) ; U15.1 8.46,71.13 8.65,70.94 8.65,69.78 v2(8.64,69.77)
  Top Layer w0.2: v2(4.14,62.56) 5.54,63.96 R10.1
  Top Layer w0.203: U32.2 2.52,66.28 Q4.2
  内层1 w0.152: v2(3.81,67.95) 3.82,68.2 4.06,68.46 7.8,68.49 8.65,69.78
  Inner2 w0.203: v2(4.14,62.56) 4.14,63.89 7.17,67.38 7.13,70.47 v2(7.68,71.1)
(no net):
  vias: v1(3.44,57.94)
BAT: length 18.1
  Top Layer w0.152: Q4.3 3.44,64.06 v2(3.94,64.55) ; v2(5.92,67.77) 5.92,66.55 R11.1
  Inner2 w0.203: v2(3.23,67.21) 4.78,67.21 4.77,70.78 6.22,70.78 v2(6.61,71.1) 6.61,67.61 v2(3.94,64.55) ; 4.77,68.3 5.39,68.3 v2(5.92,67.77)
J2_A5: length 4.3
  Bottom Layer w0.2: v2(9.29,78.65) 10.99,76.95 USB1.A5
J2_B5: length 4.1
  Bottom Layer w0.2: v2(15.13,78.7) 13.99,77.56 13.99,75.09
KEY_A: length 14.2
  Top Layer w0.152: U3.G1 16.73,62.96 v2(16.75,62.94)
  Bottom Layer w0.152: 18.13,75.42 18.13,74.46 18.42,74.18 18.42,69.76 SW1.4 18.13,64.31 v2(16.75,62.94)
KEY_B: length 16.4
  Top Layer w0.152: v2(8.83,66.01) 9.29,66.01 U3.W24
  Bottom Layer w0.152: 2.59,75.42 1.96,74.88 2,70.46 SW2.4 3.56,69.46 6.32,64.7 7.14,64.69 v2(8.83,66.01)
LED1: length 12.8
  Top Layer w0.152: U3.L1 v2(16.75,63.94)
  Inner2 w0.152: v2(16.75,63.94) 17.22,63.94 18.05,64.7 18.05,70.96 18.31,71.6 18.31,72.73 18.55,73 19.48,72.99 19.77,73.28 v2(19.77,73.81)
LED1_2: length 25.6
  内层1 w0.152: v2(4.64,72.14) 5.34,71.45 6.11,71.45 6.68,72.02 v2(6.68,72.14) 7.24,71.58 8.15,71.58 8.71,72.14 v2(8.71,72.14) 9.27,71.58 10.28,71.58 10.74,72.04 v2(10.74,72.14) 11.3,71.58 12.21,71.58 v2(12.77,72.14) 13.34,71.58 14.36,71.58 14.8,72.02 v2(14.8,72.14) 15.37,71.58 16.4,71.58 16.84,72.02 v2(16.84,72.14) 17.4,71.58 18.43,71.58 18.87,72.02 v2(18.87,72.14)
  Bottom Layer w0.152: v2(4.64,72.14) 4.44,72.35 4.44,73.28 3.6,73.28 3.32,73.56 3.32,76.28 4.97,76.28 5.47,75.78 v2(5.47,75.64)
LED1_3: length 22.8
  内层1 w0.152: v2(5.55,72.14) 6.07,72.67 7.05,72.67 v2(7.58,72.14) 8.11,72.67 9.29,72.67 9.61,72.35 v2(9.61,72.14) 10.18,72.71 11.07,72.71 v2(11.64,72.14) 12.19,72.69 12.19,72.72 13.35,72.72 13.35,72.72 13.67,72.4 v2(13.67,72.14) 14.25,72.72 15.12,72.72 v2(15.71,72.14) 16.28,72.72 17.3,72.73 17.81,72.13 18.42,72.74 19.19,72.72 v2(19.77,72.14)
  Bottom Layer w0.152: R5.2 3.18,72.98 4.05,72.98 4.05,71.86 4.33,71.58 4.98,71.58 v2(5.55,72.14)
  Bottom Layer w0.2: 5.47,72.22 v2(5.55,72.14)
  vias: v2(2.43,73.77) v2(17.81,72.13)
LED2: length 10.3
  Top Layer w0.152: U3.N1 v2(16.33,64.44)
  Inner2 w0.152: v2(16.33,64.44) 16.96,65.3 17.05,71.14 17.32,71.6 17.32,72.83 17.74,73.28 v2(17.74,73.81)
LED3: length 9.4
  Top Layer w0.152: U3.R1 16.36,65.45
  Inner2 w0.152: v2(15.71,73.81) 15.71,73.28 16.28,72.72 16.26,71.05 16.65,70.05 16.66,66.5 16.36,65.45
  vias: v2(16.36,65.47)
LED4: length 10.8
  Top Layer w0.152: U3.U1 v2(15.04,65.71)
  Inner2 w0.152: v2(13.67,73.81) 13.67,73.26 14.25,72.75 14.25,71.82 16.35,69.76 16.35,66.59 v2(15.04,65.71)
LED5: length 7.1
  Top Layer w0.152: U3.AD8 v2(13.84,67.97)
  Inner2 w0.152: v2(11.64,73.55) 12.21,72.99 12.2,71.47 13.84,70.19 v2(13.84,67.97)
LED6: length 9.2
  Top Layer w0.152: v2(13.34,68.48) U3.AD10
  Inner2 w0.152: v2(9.61,73.81) 10.14,73.28 10.14,70.91 10.61,70.44 12.84,70.44 13.34,69.99 v2(13.34,68.48)
LED7: length 10
  Top Layer w0.152: U3.AD12 v2(12.84,67.97)
  Inner2 w0.152: v2(7.58,73.81) 7.62,73.81 8.15,73.28 8.15,71.58 9.68,70.05 12.02,70.05 12.84,69.39 v2(12.84,67.97)
LED8: length 12.8
  Top Layer w0.152: 11.83,67.98 11.83,67.47 U3.AD16
  内层1 w0.152: v2(5.55,73.81) 4.08,72.34 4.08,71.83 4.33,71.58 4.7,71.57 5.65,70.66 9.39,70.66 11.83,68.92 11.83,67.98 v2(11.84,67.97)
LED_B_H: length 10.7
  Top Layer w0.152: v2(10.34,68.22) U3.AD22
  Bottom Layer w0.152: 2.43,72.05 2.43,71.58 5.22,68.42 7.95,68.45 10.07,68.46 v2(10.34,68.22)
  vias: v2(2.43,72.22)
LED_G_H: length 14.4
  Top Layer w0.152: U3.AD18 v2(11.34,68.48)
  Bottom Layer w0.152: v2(3.92,75.64) 3.92,73.64 3.95,73.61 4.59,73.61 5.22,72.98 ; 5.22,72.98 6.12,72.98 ; 5.22,72.98 6.12,72.98 ; 6.12,72.98 6.12,71.62 ; 6.12,71.58 8.47,71.58 11.34,68.66 v2(11.34,68.48)
LED_R_H: length 10.6
  Top Layer w0.152: v2(10.84,67.97) U3.AD20
  Bottom Layer w0.15: 8.94,70.57 10.84,68.72 v2(10.84,67.97)
  Bottom Layer w0.152: v2(3.44,72.18) 3.44,71.11 4,70.65 8.88,70.66
LEDFILELD: length 28
  Top Layer w0.152: U3.Y23 v2(10.46,66.21)
  Bottom Layer w0.152: v2(10.46,66.21) 10.48,65.47 9.35,64.44 7.49,64.45 6.39,63.88 6.4,61.9 6.23,61.71 6.23,51.27 11.26,46.29 12.42,46.29 v2(13.2,45.57)
LF_AMP_PWR: length 13.1
  Top Layer w0.152: U3.A14 12.34,59.76 v2(12.2,59.41) ; 12.45,58.37 v2(11.78,58.36) ; C25.1 15.96,54.12 16.32,54.47 U9.8
  Inner2 w0.152: v2(11.78,58.36) 11.78,54.46 11.99,54.25 12.85,54.24 v2(14.62,54.24)
  Bottom Layer w0.152: v2(11.78,58.36) 11.78,59.3 v2(12.2,59.41)
  vias: v2(16.03,54.23)
LF_ANT_DRV: length 23
  Top Layer w0.152: U3.A8 13.84,60.96 v2(14.43,60.96)
  内层1 w0.152: v2(3.84,48.92) 3.45,49.3 3.45,54 4.71,54.8 11.4,54.8 13.6,56.66 13.6,57.23 14.49,58.12 14.49,58.75 14.49,58.97 15.62,59.56 15.64,60.15 14.83,60.96 v2(14.43,60.96)
LF_ENV_DETE: length 12.4
  Top Layer w0.152: 17.16,46.16 16.47,46.61 16.44,49.51 R25.1
  Top Layer w0.2: v2(20.14,51.77) 20.14,50.43 20.08,50.37
  内层1 w0.152: v2(17.16,50.23) 16.64,50.81 16.64,51.93 v2(17.67,52.77) 19.45,52.77 v2(20.14,51.77)
LF_MOD: length 16
  Top Layer w0.152: U3.A16 11.84,60.48 v2(11.86,60.45)
  Bottom Layer w0.152: v2(11.86,60.45) 11.9,60.45 12.71,59.64 12.63,55.21 16.65,51.26 16.63,50.36 16.28,50 14.62,49.99 14.49,49.86 14.49,49.61 13.96,49.08
LF_OA: length 12.5
  Bottom Layer w0.5: 17.36,46.88 18.31,48.49 19.81,48.86
  Bottom Layer w0.6: 15.76,46.55 15.8,46.59 17.16,46.59 17.47,47.82 18.09,49 19.03,48.97 19.45,49.1 v2(20.14,49.1)
  Bottom Layer w0.7: 15.81,46.54 16.7,47.15 17.46,48.95
LF_OA_OUT: length 13.2
  Top Layer w0.152: U3.A10 13.34,60.65 13.44,60.55 ; 17.67,54.47 17.67,54.93 17.48,55.25 v2(17.48,55.96) 17.48,56.48 17.69,56.69 19.78,56.69 20.17,56.3 20.17,55.96
  Bottom Layer w0.152: v2(13.38,60.64) 13.88,60.64 14.37,59.86 14.37,57.74 16.02,55.96 v2(17.48,55.96)
LF_RSSI: length 18.2
  Top Layer w0.152: U3.A12 12.82,60.94 12.82,60.42
  Bottom Layer w0.152: v2(12.81,60.41) 12.81,60.06 13.1,59.77 13.1,57.86 13.6,57.35 13.6,55.96 15.64,53.93 15.64,53.8 17.77,51.72 17.76,50.22 17.52,49.82 16.78,49.8 15.95,49.65 15.54,49.27 15.52,48.58 R17.2 15.14,47.32 D2.2
LF_VBIAS: length 20.2
  Top Layer w0.152: U9.3 18.18,52.61 18.18,52.27 18.3,52.13 18.93,52.13 19.06,52.27 19.07,54.29 18.9,54.47 18.67,54.47 ; v2(19.32,53.93) 19.07,53.93 ; C28.2 20.98,60.08 20.98,59.5 21.36,59.12 R21.2
  内层1 w0.152: v2(19.32,53.93) 18.6,54.22 17.82,54.22 16.57,52.66 v2(16.03,52.66) 16.03,53.16 17.68,55.26 20.89,56.72 20.89,58.33 21.73,59.17
  vias: v2(21.73,59.17)
MISO: length 7.9
  Top Layer w0.152: 14.78,65.11 14.89,65.21 U3.T2
  内层1 w0.152: 14.78,65.11 15.15,65.11 15.82,64.48 15.82,60.85 15.97,60.42 15.97,59.31 v2(15.32,58.87)
  vias: v2(14.81,65.11)
MOSI: length 9.9
  Top Layer w0.152: U3.P23 v2(9.84,64.2) ; 14.61,59.65 14.94,59.65 15.12,59.83
  Inner2 w0.152: v2(9.84,64.2) 10.47,63.57 10.46,63.06 10.47,62.25 10.69,62.06 13.04,62.06 13.59,61.51 14.65,61.51 14.87,61.29 14.87,60.91 15.23,60.56 15.23,59.93 v2(15.06,59.76)
NFC_ANT_SEL: length 18.6
  Top Layer w0.152: U3.A20 10.84,60.63 10.94,60.53 11.32,60.53 11.32,59.88 v2(11.47,59.73)
  Inner2 w0.152: v2(9.18,50.65) 11.14,52.89 11.14,58.82 v2(11.47,59.73)
  Bottom Layer w0.152: v2(9.18,50.65) 16.04,50.65 v2(16.16,50.52)
NFC_NRF_A: length 20.9
  Top Layer w0.152: v2(8.67,63.43) 8.7,63.46 U3.J24 ; Q1.2 15.73,50.89 v2(15.73,51.51)
  Bottom Layer w0.152: 8.67,63.43 8.67,63.12 7.89,62.35 7.95,59.58 8.25,59 8.23,52.8 9.54,51.51 v2(15.73,51.51)
NFC_NRF_B: length 16.7
  Top Layer w0.152: v2(8.64,51.51) 8.38,51.25 Q2.2 ; U3.L24 v2(8.83,63.96)
  Bottom Layer w0.152: v2(8.64,51.51) 6.62,53.16 6.62,61.37 6.79,61.91 6.77,63.64 7.34,63.96 v2(8.83,63.96)
NSS: length 11.7
  Top Layer w0.152: U3.R24 8.66,64.95
  内层1 w0.152: 8.66,64.95 8.04,64.42 8.04,62.98 8.42,62.54 8.43,60.84 9.8,58.87 13.14,58.87 13.6,59.33 13.6,59.39 13.61,59.39
  vias: v2(8.53,64.95) v2(13.61,59.39)
OSC27OUT: length 5.4
  Top Layer w0.152: U4.10 15.74,57.87 16.23,57.52 17.08,57.52
  内层1 w0.152: v2(17.13,57.62) 17.54,58.04 v2(17.54,60.97)
P_LF_ANT_RAW:
  vias: v2(11.32,23.47) v2(12.98,23.48) v2(13.19,34.8)
R6_2: length 19.3
  Bottom Layer w0.152: v2(5.87,62.56) 5.87,51.16 v2(11.48,45.54)
RESET: length 0.6
  Top Layer w0.2: U3.AC13 v2(12.59,66.33)
RX: length 15.4
  Top Layer w0.152: U4.9 15.5,57.37 v2(15.67,57.2)
  Top Layer w0.2: 7.51,47.23 v2(7.51,48.43)
  内层1 w0.2: v2(7.51,48.43) 15.36,52.26 15.36,54.8 15.67,55.22 v2(15.67,57.2)
SCK: length 13.3
  Top Layer w0.152: U3.U24 v2(8.83,65.46) ; 14.11,59.65 14.11,60.02 14.41,60.39 14.75,60.39
  内层1 w0.152: v2(8.83,65.46) 9.16,65.46 9.33,65.25 9.34,63.12 8.78,62.56 8.78,61.04 8.85,60.96 12.26,60.96 12.59,61.29 13.6,61.29 14.34,60.32 14.7,60.32
  vias: v2(14.71,60.3)
SWCLK: length 3.1
  Top Layer w0.152: v2(8.83,66.57) 8.93,66.46 U3.AA24
  Bottom Layer w0.152: NOREF.1 7.19,65.84 7.71,65.84 8.43,66.57 v2(8.83,66.57)
SWDIO: length 1.4
  Top Layer w0.152: v2(8.83,67.12) 9.18,67.12 U3.AC24
  Bottom Layer w0.152: 8.02,67.26 8.16,67.12 v2(8.83,67.12)
TX1: length 3.6
  Top Layer w0.2: L1.2 12.45,55 12.45,57.37
TX2: length 2.9
  Top Layer w0.2: U4.6 13.61,54.88 L2.2
U1_2: length 1.1
  Top Layer w0.2: U1.2 14.37,77.3 R16.2
U3_AC5: length 6.7
  Top Layer w0.152: U3.AC5 14.59,66.96 v2(14.59,66.45)
  内层1 w0.152: v2(14.59,66.45) 16.66,68.53 18.76,68.53 19.45,69.21 19.45,69.42
  vias: v2(19.45,69.35)
U3_B3: length 8.4
  Top Layer w0.152: U3.B3 v2(15.34,61.06)
  Inner2 w0.152: v2(15.34,61.06) 15.98,61.06 16.14,61.41 20.47,61.41 20.97,61.55 20.97,62.67 v2(20.32,63.32)
U3_C1: length 4.6
  Top Layer w0.152: U3.C1 v2(16.36,61.86)
  内层1 w0.152: v2(16.36,61.86) 16.99,61.86 17.35,62.09 v2(17.35,65.1)
U3_D2: length 11.6
  Top Layer w0.152: v2(14.64,62.71) 15.34,62.21 ; C36.2 21.71,66.4 v2(21.71,64.94)
  Inner2 w0.152: v2(14.64,62.71) 15.35,62.71 15.63,62.44 19.56,62.44 19.56,63.94 19.7,64.09 20.85,64.09 v2(21.71,64.94)
U3_D23: length 10.3
  Top Layer w0.152: U3.D23 v2(9.86,61.49)
  Inner2 w0.152: v2(4.24,56.47) 4.91,56.47 8.05,56.5 8.34,56.91 8.3,59.39 8.3,60.03 v2(9.86,61.49)
U3_E24: length 26.4
  Top Layer w0.152: U3.E24 v2(9.34,61.99) ; 14.59,61.46 v2(14.32,62.14) ; v2(20.32,62.05) 20.35,62.05 20.92,62.6 v2(20.84,69.55) ; v2(20.84,69.55) 20.59,69.8 20.59,72.66 C45.2 ; v2(20.84,69.55) 21.48,70.18 C44.2
  Bottom Layer w0.152: v2(9.34,61.99) 13.95,61.98 v2(14.32,62.14) 15.09,62.14 16.14,61.41 19.63,61.41 20.28,61.96 20.28,62.04
U3_F2: length 10.6
  Top Layer w0.152: v2(14.65,63.36) U3.F2 ; C37.2 20.19,66.51 v2(20.19,64.94)
  Bottom Layer w0.152: v2(14.65,63.36) 14.7,63.36 15.63,62.44 19.56,62.44 19.56,64.32 v2(20.19,64.94)
U31_1: length 18.7
  Top Layer w0.152: v2(5.48,70.21) 5.84,69.23 U31.1
  内层1 w0.152: v2(5.48,70.21) 5,70.12 3.87,70.12 2.96,71.04 2.96,72.98 4.61,74.63 6.36,74.63 7,75.26 7,77.47 7.32,77.79 11.16,77.79 v2(11.66,77.29)
USB+: length 11.4
  Top Layer w0.152: v2(14.32,68.46) 14.32,67.46
  内层1 w0.152: v2(12.01,76.05) 12.95,76.05 v2(12.97,76.07)
  Bottom Layer w0.152: USB1.A6 11.99,74.47 12.15,74.24 12.13,73.21 12.68,72.61 13.1,72.62 13.22,72.48 13.24,71.4 13.74,71.12 13.73,69.67 14.32,68.76 v2(14.32,68.46) ; v2(12.01,76.05) 12.01,75.4 ; v2(12.97,76.07) 12.97,75.11 USB1.B6
USB-: length 12.8
  Top Layer w0.152: v2(14.86,67.95) 14.84,67.93 U3.AD4
  Bottom Layer w0.152: USB1.B7 11.49,76.32 11.7,76.53 12.27,76.53 12.49,76.33 USB1.A7 ; 12.48,75.09 12.51,73.3 12.79,73.02 13.98,73.02 14.16,72.71 14.15,71.82 14.15,69.81 14.85,68.84 v2(14.86,67.95)
VMID: length 14.7
  Top Layer w0.152: 7.51,50.02 7.51,50.61 7.89,51.24 7.89,53.17 8.22,53.49 9.61,53.49 v2(10.24,52.78) C8.1 ; U4.8 14.61,56.6 v2(14.87,56.34)
  内层1 w0.152: v2(10.24,52.78) 12.19,52.78 14.87,55.47 v2(14.87,56.34)
VUSB: length 9.9
  Inner2 w0.299: USB1.A4B9 9.84,75.67 10.36,76.58 11.86,76.58 F1.2
  Inner2 w0.3: v2(13.73,78.72) 13.99,78.45 13.99,76.05 14.62,75.42 14.62,75.13
  vias: v2(9.84,75) v2(14.63,75.09)
C13_1: length 2.9
  Top Layer w0.254: 12.84,52.77 12.84,51.45 C15.1 C13.1
C20_1: length 1.2
  Top Layer w0.2: 7.51,45.68 8.71,45.67
C30_1: length 1.3
  Top Layer w0.2: 21.64,50.37 21.64,49.19 C30.1
L1_1: length 2.7
  Top Layer w0.254: C12.2 C14.1 11.57,52.62
L3_2: length 4
  Top Layer w0.298: U13.2 3.63,61.28 5.93,61.28 5.93,59.97 5.86,59.89
L4_2: length 1.3
  Top Layer w0.152: L4.2 L5.1
LED1_1: length 21.5
  Top Layer w0.2: 3.57,73.6 4.44,73.6 LED8.1 4.84,73.61 4.84,73.36 5.22,72.98 5.35,72.98 ; 5.39,72.98 18.94,72.98 18.94,73.74 LED1.1
  Top Layer w0.254: LED9.1 6.68,73.01 ; LED4.1 8.71,73.04 ; LED5.1 10.74,73.01 ; LED6.1 12.77,73 ; LED3.1 14.8,73.01 ; LED2.1 16.84,73.01
LF_OA1: length 6.5
  Top Layer w0.152: 17.17,52.54 17.17,52.39 17.39,52.17 17.87,52.18 18.58,51.5 18.62,51.5
  Top Layer w0.2: 17.16,48.68 C47.2 ; 17.16,48.69 17.92,49.45 17.91,50.82 18.58,51.5
OSC27IN: length 6.2
  Top Layer w0.152: U4.11 15.77,58.37 15.89,58.37 18.29,58.37 19.05,59.13 19.19,59.13 ; 18.94,61.02 18.94,59.64 19.32,59.26
P_LF_ANT_DRV: length 3.6
  Top Layer w0.152: U7.4 2.54,47.97 3.78,46.73 P3.1
Q1_3: length 1
  Top Layer w0.152: 15.76,48.5 15.76,49.46
Q2_3: length 1.2
  Top Layer w0.152: C10.2 8.78,49.71
Q3_3: length 8.6
  Bottom Layer w0.152: Q3.3 15.02,49.12 13.98,48.08 13.98,45.16 14.87,44.27 16.39,44.27 R15.2
R10_2: length 5.6
  Top Layer w0.152: U15.3 7.68,68.78 8.02,68.29 8.06,64.72 7.41,63.96
R13_1: length 1.3
  Top Layer w0.152: R13.1 U31.5
R18_2: length 7.4
  Top Layer w0.152: R18.2 19.25,50.65 19.25,51.95 19.45,52.15 19.45,52.36 20.21,53.13 ; 20.21,53.13 20.89,53.8 20.89,54.08 21.6,54.58 ; R20.2 21.72,54.68 21.6,54.56
U3_A23: length 4.8
  Top Layer w0.152: 9.16,57.1 9.16,57.31 9.67,57.82 9.66,58.86 X2.1 9.84,60.46 U3.A23
U3_B24: length 5.6
  Top Layer w0.152: C40.1 7.25,57.1 X2.3 8.89,58.53 9.61,59.25 9.61,60.21 9.34,60.48 U3.B24
U3_H23: length 4.6
  Top Layer w0.299: U3.H23 arc(8.47,62.39) L3.1 7.32,60.02 U11.1
U9_6: length 3.7
  Top Layer w0.152: U9.6 18.17,54.96 18.82,55.34 18.83,55.96 ; C27.2 18.88,55.89 19.57,55.2 19.73,55.2 20.21,54.72

## Copper pours and planes (outline as drawn; the poured copper is in the pictures)
GND on 内层1: 4.32,61.91 8.35,61.91 8.35,60.5 4.32,60.5
GND on 内层1: 4.75,60.51 7.94,60.51 7.94,58 4.75,58
(no net) on Top Layer: 5.76,12.45 10.63,12.45 10.63,10.16 5.76,10.16
(no net) on Top Layer: 13.68,10.16 18.55,10.16 18.55,7.86 13.68,7.86
(no net) on Top Layer: 5.76,10.16 10.63,10.16 10.63,7.86 5.76,7.86
(no net) on Top Layer: 13.68,12.45 18.55,12.45 18.55,10.16 13.68,10.16

Small or netless copper shapes (teardrops, artwork), in the pictures only: 5 on Top Layer

## Text on the board
Bottom Silkscreen Layer: + | - | G | C | D | v | JLCJLCJLCJLC
